# EAGLE design Stackduino-SMD (EAGLE 6.5.0)
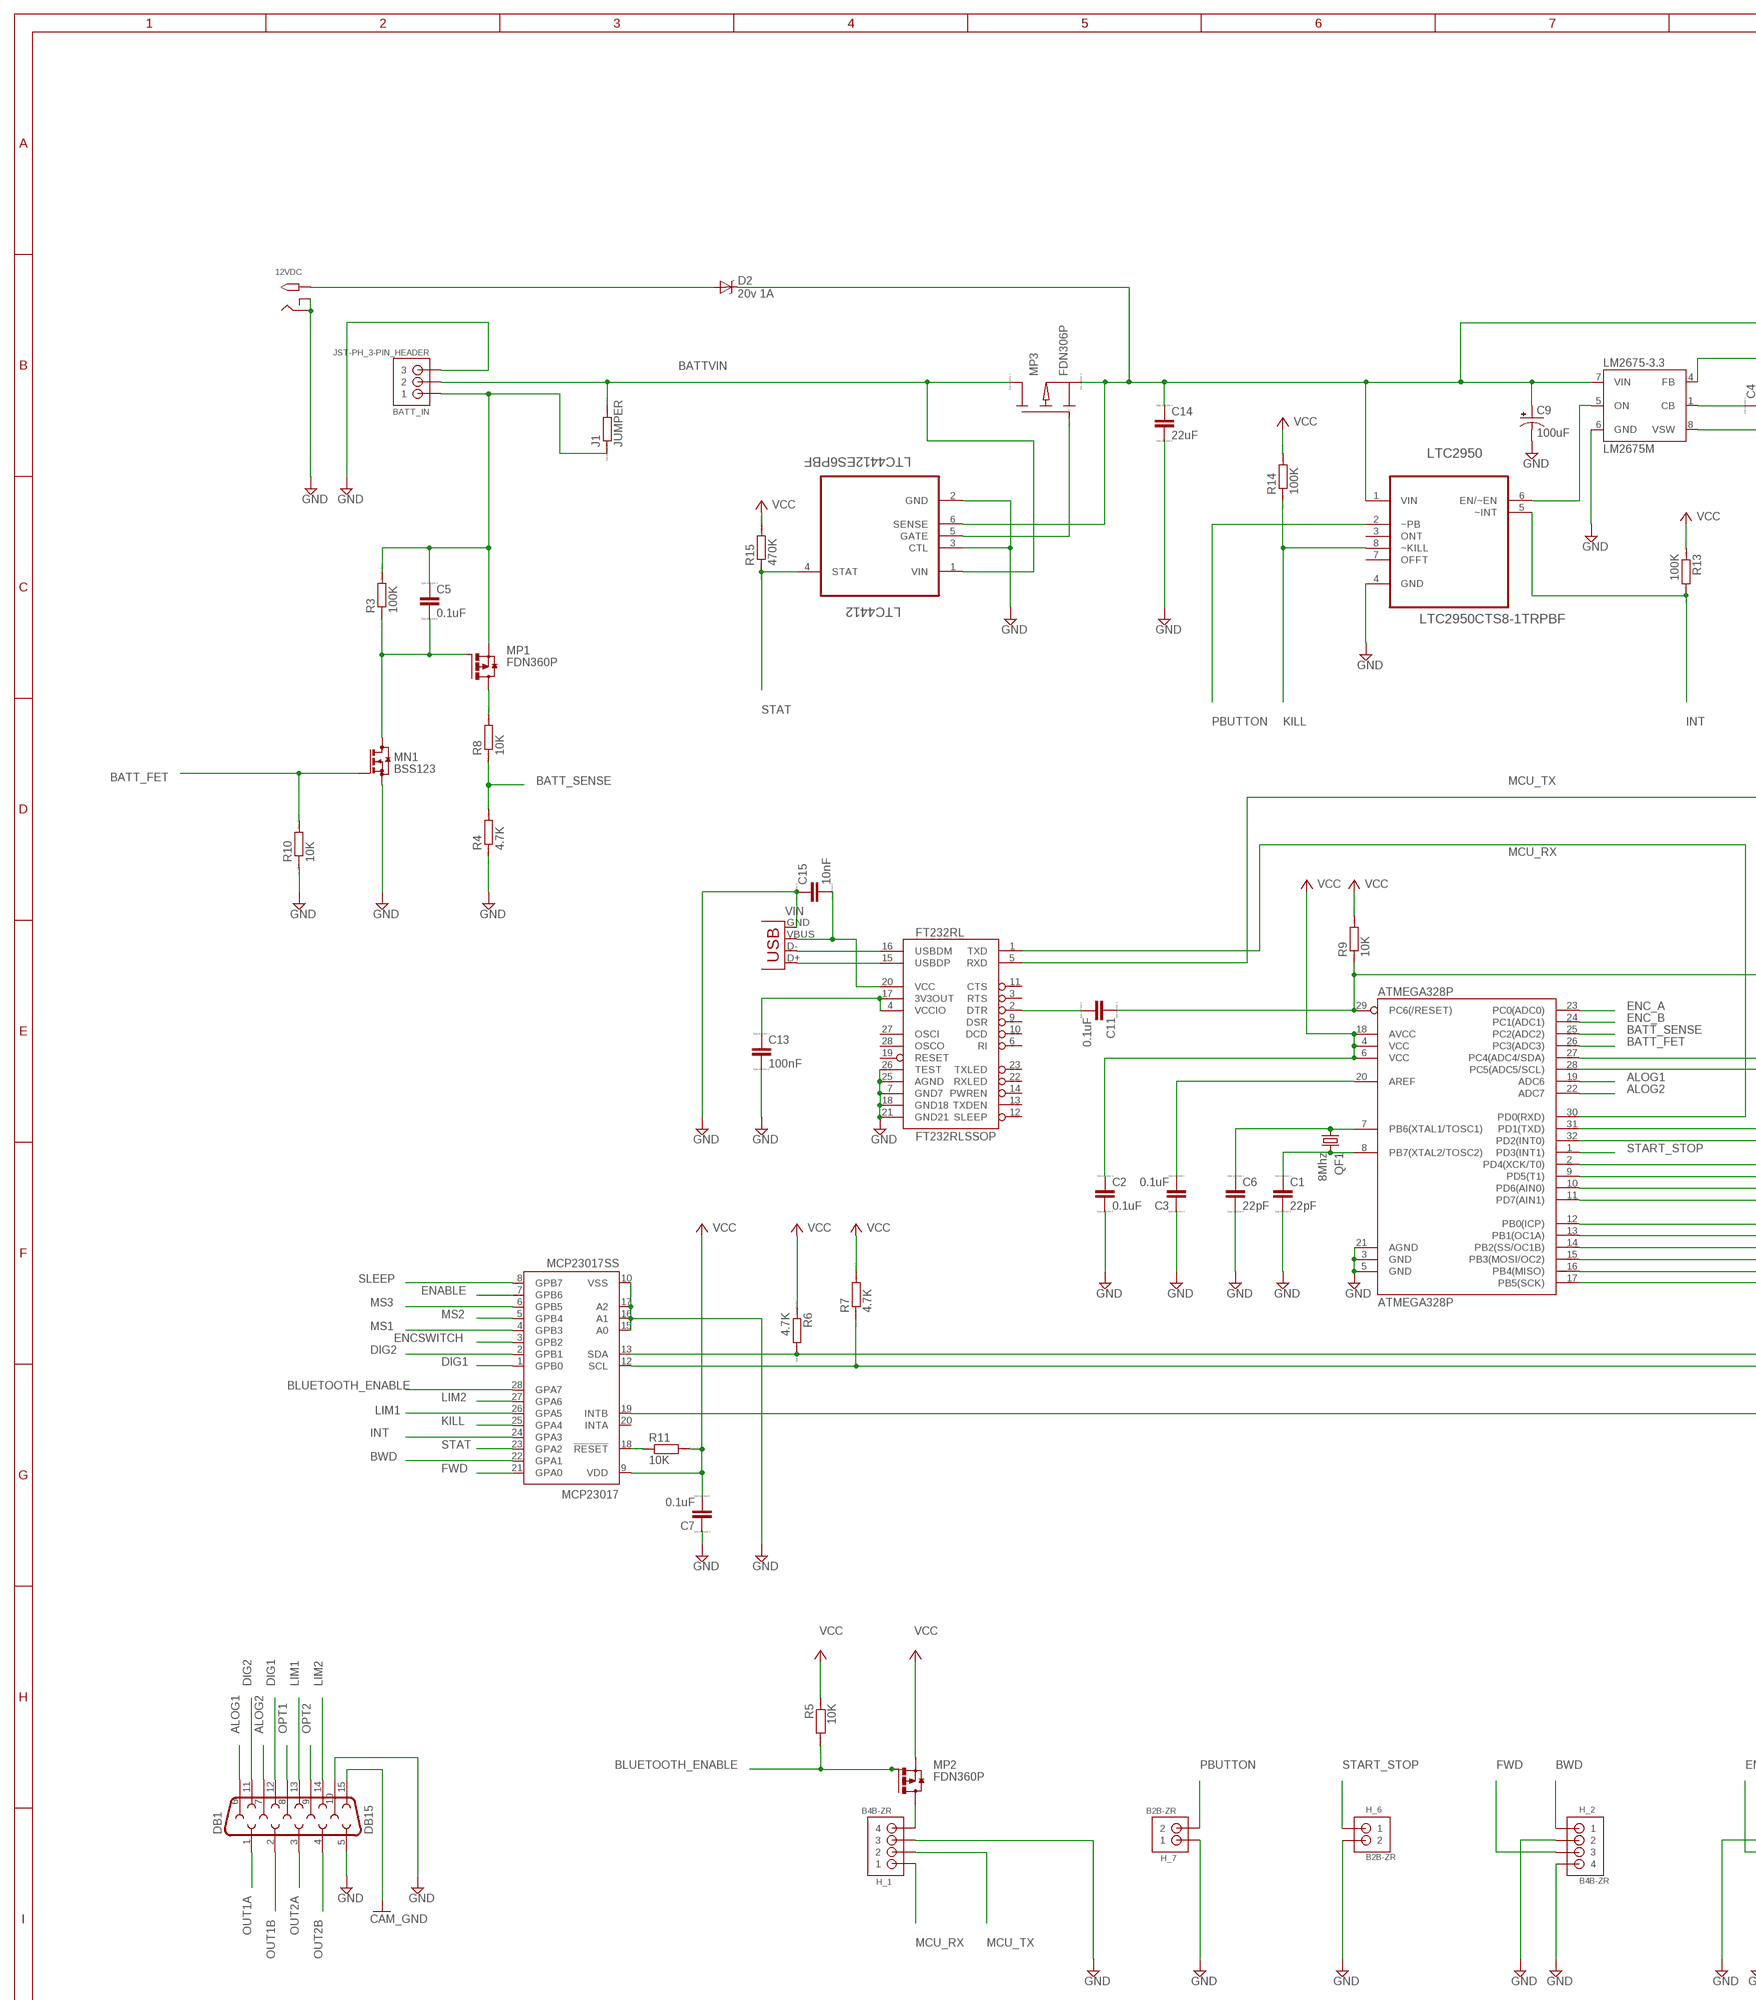
[diagram p0: schematic, sheet 1, part 1 of 2]
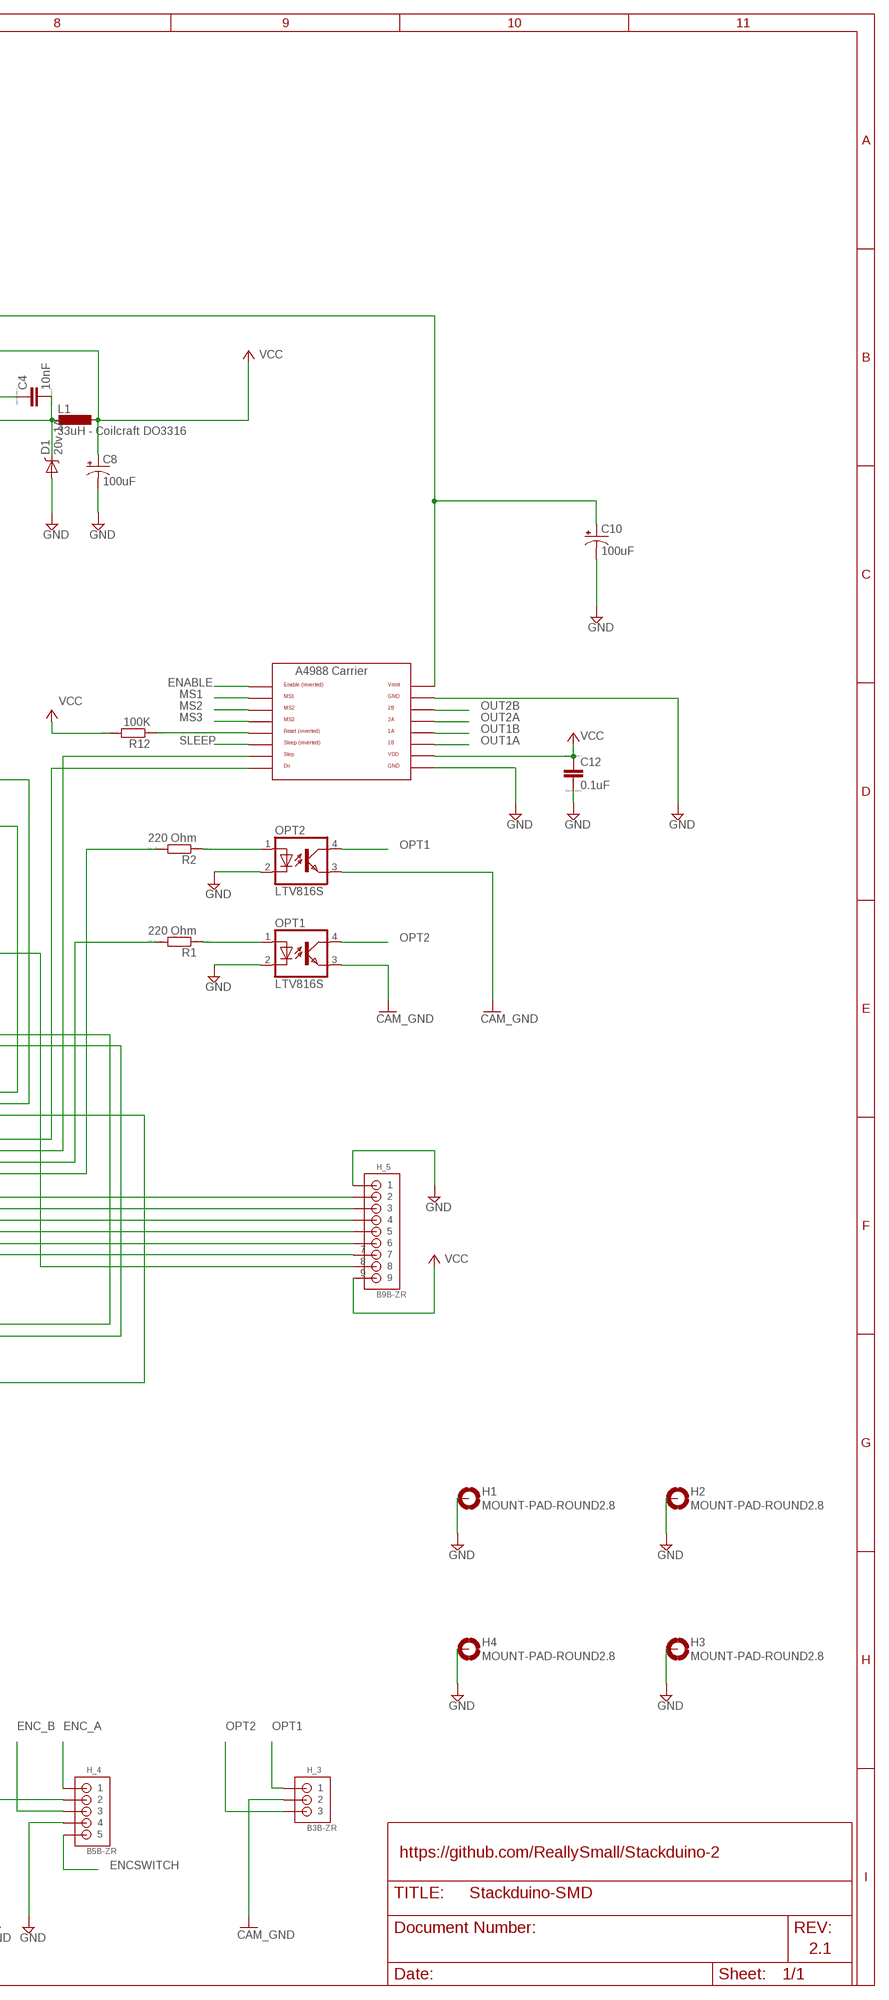
[diagram p1: schematic, sheet 1, part 2 of 2]

## Parts
12VDC  2.1MMJACKTHM  [PJ-102A]
A4988_CARRIER  A4988BREAKOUT  [A4988BREAKOUT]
ATMEGA328P  ATMEGA328P  ATMEGA328_SMT  [TQFP32-08]
BATT_IN  JST-PH_3-PIN_HEADER  [JST_B3B-PH_HEADER]
C1  22pF  C  [C0805]
C2  0.1uF  C  [C0805]
C3  0.1uF  C  [C0805]
C4  10nF  C  [C0805]
C5  0.1uF  C  [C0805]
C6  22pF  C  [C0805]
C7  0.1uF  C  [C0805]
C8  100uF  CAP_POLD  [PANASONIC_D]
C9  100uF  CAP_POLD  [PANASONIC_D]
C10  100uF  CAP_POLD  [PANASONIC_D]
C11  0.1uF  C  [C0805]
C12  0.1uF  C  [C0805]
C13  100nF  C  [C0805]
C14  22uF  C  [C0805]
C15  10nF  C  [C0805]
D1  20v 1A  MBRA140  [SMA-DIODE]
D2  20v 1A  MBRA140  [SMA-DIODE]
DB1  DB15  [DB15]
FT232RL  FT232RLSSOP  [SSOP28DB]
H1  MOUNT-PAD-ROUND2.8  [2,8-PAD]
H2  MOUNT-PAD-ROUND2.8  [2,8-PAD]
H3  MOUNT-PAD-ROUND2.8  [2,8-PAD]
H4  MOUNT-PAD-ROUND2.8  [2,8-PAD]
H_1  B4B-ZR  [B4B-ZR]
H_2  B4B-ZR  [B4B-ZR]
H_3  B3B-ZR  [B3B-ZR]
H_4  B5B-ZR  [B5B-ZR]
H_5  B9B-ZR  [B9B-ZR]
H_6  B2B-ZR  [B2B-ZR]
H_7  B2B-ZR  [B2B-ZR]
J1  JUMPER  R  [R0805]
L1  33uH - Coilcraft DO3316  DO3316P  [DO3316P]
LM2675-3.3  LM2675M  [SO08]
LTC2950  LTC2950CTS8-1TRPBF  [SOT65P280X100-8N]
LTC4412  LTC4412ES6PBF  [SOT95P280X100-6N]
MCP23017  MCP23017SS  [SSOP28]
MN1  BSS123  [SOT23]
MP1  FDN360P  [SUPER-SOT3]
MP2  FDN360P  [SUPER-SOT3]
MP3  FDN306P  PMOS  [SOT23]
OPT1  LTV816S  [SMD4]
OPT2  LTV816S  [SMD4]
QF1  8Mhz  CRYSTALHC49U-V  [HC49U-V]
R1  220 Ohm  R  [R0805]
R2  220 Ohm  R  [R0805]
R3  100K  R  [R0805]
R4  4.7K  R  [R0805]
R5  10K  R  [R0805]
R6  4.7K  R  [R0805]
R7  4.7K  R  [R0805]
R8  10K  R  [R0805]
R9  10K  R  [R0805]
R10  10K  R  [R0805]
R11  10K  R  [R0805]
R12  100K  R  [R0805]
R13  100K  R  [R0805]
R14  100K  R  [R0805]
R15  470K  R  [R0805]
USB  USBSMD  [USB-MINIB]

## Nets
ALOG1: ATMEGA328P.19(ADC6) DB1.6
ALOG2: ATMEGA328P.22(ADC7) DB1.7
BATT_FET: ATMEGA328P.26(PC3(ADC3)) MN1.1(G) R10.2
BATT_SENSE: ATMEGA328P.25(PC2(ADC2)) R4.2 R8.1
BATT_VOLT: BATT_IN.P1 C5.1 J1.1 MP1.2(S) R3.2
BATTVIN: BATT_IN.P2 J1.2 LTC4412.1(VIN) MP3.3(D)
BLUETOOTH_ENABLE: MCP23017.28(GPA7) MP2.1(G) R5.2
BWD: H_2.1 MCP23017.22(GPA1)
CAM_GND: DB1.15 H_3.2 OPT1.3(EMIT) OPT2.3(EMIT)
DIG1: DB1.12 MCP23017.1(GPB0)
DIG2: DB1.11 MCP23017.2(GPB1)
DIR: A4988_CARRIER.DIR ATMEGA328P.2(PD4(XCK/T0))
ENABLE: A4988_CARRIER.EN MCP23017.7(GPB6)
ENC_A: ATMEGA328P.23(PC0(ADC0)) H_4.1
ENC_B: ATMEGA328P.24(PC1(ADC1)) H_4.3
ENCSWITCH: H_4.5 MCP23017.3(GPB2)
FWD: H_2.3 MCP23017.21(GPA0)
GATE: LTC4412.5(GATE) MP3.1(G)
GND: 12VDC.RING 12VDC.RING_SW A4988_CARRIER.GND A4988_CARRIER.GND@0(GND) ATMEGA328P.3(GND) ATMEGA328P.5(GND) ATMEGA328P.21(AGND) BATT_IN.P3 C1.2 C2.2 C3.1 C6.2 C7.1 C8.- C9.- C10.- C12.2 C13.2 C14.2 C15.1 D1.A DB1.5 DB1.10 FT232RL.7(GND7) FT232RL.18(GND18) FT232RL.21(GND21) FT232RL.25(AGND) FT232RL.26(TEST) H1.B2,8(MOUNT) H2.B2,8(MOUNT) H3.B2,8(MOUNT) H4.B2,8(MOUNT) H_1.3 H_2.2 H_2.4 H_4.2 H_4.4 H_5.1 H_6.2 H_7.1 LM2675-3.3.6(GND) LTC2950.4(GND) LTC4412.2(GND) LTC4412.3(CTL) MCP23017.10(VSS) MCP23017.15(A0) MCP23017.16(A1) MCP23017.17(A2) MN1.2(S) OPT1.2(C) OPT2.2(C) R4.1 R10.1 USB.GND
INT: LTC2950.5(~INT) MCP23017.24(GPA3) R13.2
KILL: LTC2950.8(~KILL) MCP23017.25(GPA4) R14.1
LIM1: DB1.13 MCP23017.26(GPA5)
LIM2: DB1.14 MCP23017.27(GPA6)
MCU_RX: ATMEGA328P.30(PD0(RXD)) FT232RL.1(TXD) H_1.1
MCU_TX: ATMEGA328P.31(PD1(TXD)) FT232RL.5(RXD) H_1.2
MISO: ATMEGA328P.16(PB4(MISO)) H_5.6
MOSI: ATMEGA328P.15(PB3(MOSI/OC2)) H_5.5
MS1: A4988_CARRIER.MS1 MCP23017.4(GPB3)
MS2: A4988_CARRIER.MS2 MCP23017.5(GPB4)
MS3: A4988_CARRIER.MS3 MCP23017.6(GPB5)
N$1: LM2675-3.3.5(ON) LTC2950.6(EN/~EN)
N$2: A4988_CARRIER.RST R12.1
N$3: C11.2 FT232RL.2(DTR)
N$4: C4.1 LM2675-3.3.1(CB)
N$5: FT232RL.16(USBDM) USB.D-
N$6: FT232RL.15(USBDP) USB.D+
N$7: C4.2 D1.C L1.1 LM2675-3.3.8(VSW)
N$8: MCP23017.18(!RESET) R11.1
N$11: ATMEGA328P.20(AREF) C3.2
N$13: H_1.4 MP2.3(D)
N$14: C5.2 MN1.3(D) MP1.1(G) R3.1
N$16: MP1.3(D) R8.2
N$17: ATMEGA328P.32(PD2(INT0)) MCP23017.19(INTB)
N$18: ATMEGA328P.28(PC5(ADC5/SCL)) MCP23017.12(SCL) R7.1
N$19: ATMEGA328P.27(PC4(ADC4/SDA)) MCP23017.13(SDA) R6.2
N$22: ATMEGA328P.14(PB2(SS/OC1B)) H_5.4
N$23: ATMEGA328P.12(PB0(ICP)) H_5.2
N$24: ATMEGA328P.13(PB1(OC1A)) H_5.3
N$30: C15.2 FT232RL.20(VCC) USB.VBUS
N$34: OPT2.1(A) R2.1
N$36: OPT1.1(A) R1.1
N$43: C13.1 FT232RL.4(VCCIO) FT232RL.17(3V3OUT)
OPT1: DB1.8 H_3.1 OPT2.4(COL)
OPT2: DB1.9 H_3.3 OPT1.4(COL)
OUT1A: A4988_CARRIER.1B DB1.1
OUT1B: A4988_CARRIER.1A DB1.2
OUT2A: A4988_CARRIER.2A DB1.3
OUT2B: A4988_CARRIER.2B DB1.4
PBUTTON: H_7.2 LTC2950.2(~PB)
PD6: ATMEGA328P.11(PD7(AIN1)) R2.2
PD7: ATMEGA328P.10(PD6(AIN0)) R1.2
RESET: ATMEGA328P.29(PC6(/RESET)) C11.1 H_5.8 R9.1
SCK: ATMEGA328P.17(PB5(SCK)) H_5.7
SLEEP: A4988_CARRIER.SLP(SLEEP) MCP23017.8(GPB7)
START_STOP: ATMEGA328P.1(PD3(INT1)) H_6.1
STAT: LTC4412.4(STAT) MCP23017.23(GPA2) R15.1
STEP: A4988_CARRIER.STEP ATMEGA328P.9(PD5(T1))
V+: A4988_CARRIER.VMOT C9.+ C10.+ C14.1 D2.C LM2675-3.3.7(VIN) LTC2950.1(VIN) LTC4412.6(SENSE) MP3.2(S)
VCC: A4988_CARRIER.VDD ATMEGA328P.4(VCC) ATMEGA328P.6(VCC) ATMEGA328P.18(AVCC) C2.1 C7.2 C8.+ C12.1 H_5.9 L1.2 LM2675-3.3.4(FB) MCP23017.9(VDD) MP2.2(S) R5.1 R6.1 R7.2 R9.2 R11.2 R12.2 R13.1 R14.2 R15.2
VIN: 12VDC.TIP D2.A
XTAL1: ATMEGA328P.7(PB6(XTAL1/TOSC1)) C6.1 QF1.1
XTAL2: ATMEGA328P.8(PB7(XTAL2/TOSC2)) C1.1 QF1.2
Unconnected: FT232RL.3(RTS) FT232RL.6(RI) FT232RL.9(DSR) FT232RL.10(DCD) FT232RL.11(CTS) FT232RL.12(SLEEP) FT232RL.13(TXDEN) FT232RL.14(PWREN) FT232RL.19(RESET) FT232RL.22(RXLED) FT232RL.23(TXLED) FT232RL.27(OSCI) FT232RL.28(OSCO) LTC2950.3(ONT) LTC2950.7(OFFT) MCP23017.20(INTA)

## Notes on the sheet
- https://github.com/ReallySmall/Stackduino-2
- 2.1

## Library data of the parts
12VDC = adafruit:2.1MMJACK: 2.1mm x 5.5mm THM DC jack with internal switch. Digikey part #PJ-102A, 4UCON part #05537 2.1mm x 5.5mm SMT DC jack with internal switch. Digikey part #PJ-002A-SMT, 4UCON part #03267 By microbuilder.eu & adafruit.com
A4988_CARRIER = RepRapjr:A4988BREAKOUT
ATMEGA328P = SparkFun-DigitalIC:ATMEGA328_SMT: 32-Pin Atmega328 part Commonly used on Arduino compatible boards Available in QFP and QFN packages TQFP is IC-09069 QFN is non-stock; PROD_ID: IC-09069
BATT_IN = SRG:JST-PH_3-PIN_HEADER: 3-pin JST PH Shrouded Header, top entry P/N B3B-PH-K-S Mating connector PHR-3
C1-C7 C11-C15 = eagle-ltspice:C: CAPACITOR, European symbol; SPICEMODEL: NONE; SPICEPREFIX: C
C8-C10 = SparkFun-Passives:CAP_POL: Capacitor Polarized These are standard SMD and PTH capacitors. Normally 10uF, 47uF, and 100uF in electrolytic and tantalum varieties. Always verify the external diameter of the through hole cap, it varies with capacity, voltage, and manufacturer. The EIA devices should be standard.
D1 D2 = SparkFun-DiscreteSemi:MBRA140: 40V, 1A Schottky rectifier SMA/DO-214AC package DIO-08053; PROD_ID: DIO-08053
DB1 = SparkFun-Connectors:DB15: DB15 / VGA right angle through-hole female connector.
FT232RL = SparkFun-DigitalIC:FT232RL: USB UART FT232RL 4th Generation USB UART (USB <-> Serial) Controller. Spark Fun Electronics SKU : COM-00650 Production SKU IC-00870; PROD_ID: IC-00870
H1-H4 = holes:MOUNT-PAD-ROUND: MOUNTING PAD, round
H_1 H_2 = jst-connectors:B4B-ZR: JST-ZH Connector 4 pol, 1.5mm pitch Package: B4B-ZR Source: http://www.jst-mfg.com/product/pdf/eng/eZH.pdf
H_3 = jst-connectors:B3B-ZR: JST-ZH Connector 3 pol, 1.5mm pitch Package: B3B-ZR Source: http://www.jst-mfg.com/product/pdf/eng/eZH.pdf
H_4 = jst-connectors:B5B-ZR: JST-ZH Connector 5 pol, 1.5mm pitch Package: B5B-ZR Source: http://www.jst-mfg.com/product/pdf/eng/eZH.pdf
H_5 = jst-connectors:B9B-ZR: JST-ZH Connector 9 pol, 1.5mm pitch Package: B9B-ZR
H_6 H_7 = jst-connectors:B2B-ZR: JST-ZH Connector 2 pol, 1.5mm pitch Package: B2B-ZR
J1 R1-R15 = eagle-ltspice:R: RESISTOR, European symbol; SPICEMODEL: NONE; SPICEPREFIX: R
L1 = inductor-coilcraft:DO3316P: COILCRAFT; OC_FARNELL: unknown; OC_NEWARK: unknown
LM2675-3.3 = v-reg-3:LM2675: National Semiconductor <http://www.national.com> 1.0A "Simple Switcher"(c) 260kHz, Vout 1.2-37V, Vin 40V, 250mOhm DMOS switch, 50µA standby current
LTC2950 = LTC_By_element14_Batch_1:LTC2950CTS8-1TRPBF: Push Button On/Off Controller; MPN: LTC2950CTS8-1#TRPBF; OC_FARNELL: 1537418; OC_NEWARK: 56M7180; PACKAGE: TSOT-23-8; SUPPLIER: Linear Technology
LTC4412 = LTC_By_element14_Batch_1:LTC4412ES6PBF: Low Loss PowerPath Controller; MPN: LTC4412ES6#PBF; OC_FARNELL: 1531480; OC_NEWARK: 61M3335; PACKAGE: TSOT-23-6; SUPPLIER: Linear Technology
MCP23017 = adafruit:MCP23017: http://ww1.microchip.com/downloads/en/DeviceDoc/21952a.pdf Source: http://ww1.microchip.com/downloads/en/DeviceDoc/21952a.pdf
MN1 = transistor-small-signal:BSS123: N-CHANNEL MOS FET
MP1 MP2 = transistor-power:FDN360P: Single P-Channel, PowerTrench (R) MOSFET Source: http://www.fairchildsemi.com/ds/FD/FDN360P.pdf
MP3 = sym:PMOS: P-Channel MOSFET transistor
OPT1 OPT2 = optocoupler:LTV816: OPTO COUPLER Source: LITEON, LTV816.pdf; OC_FARNELL: unknown; OC_NEWARK: unknown
QF1 = crystal:CRYSTAL: CRYSTAL; OC_FARNELL: 1666969; OC_NEWARK: unknown
USB = SparkFun-Connectors:USB: USB Connectors USB-B-PTH is fully proven SKU : PRT-00139/CONN-08278 USB-miniB is fully proven SKU : PRT-00587 USB-A-PCB is untested. USB-A-H is throughly reviewed, but untested. Spark Fun Electronics SKU : PRT-00437 USB-B-SMT is throughly reviewed, but untested. Needs silkscreen touching up. USB-A-S has not been used/tested USB-MB-H has not been used/tested USB-MICROB has been used. CONN-09505

## Board
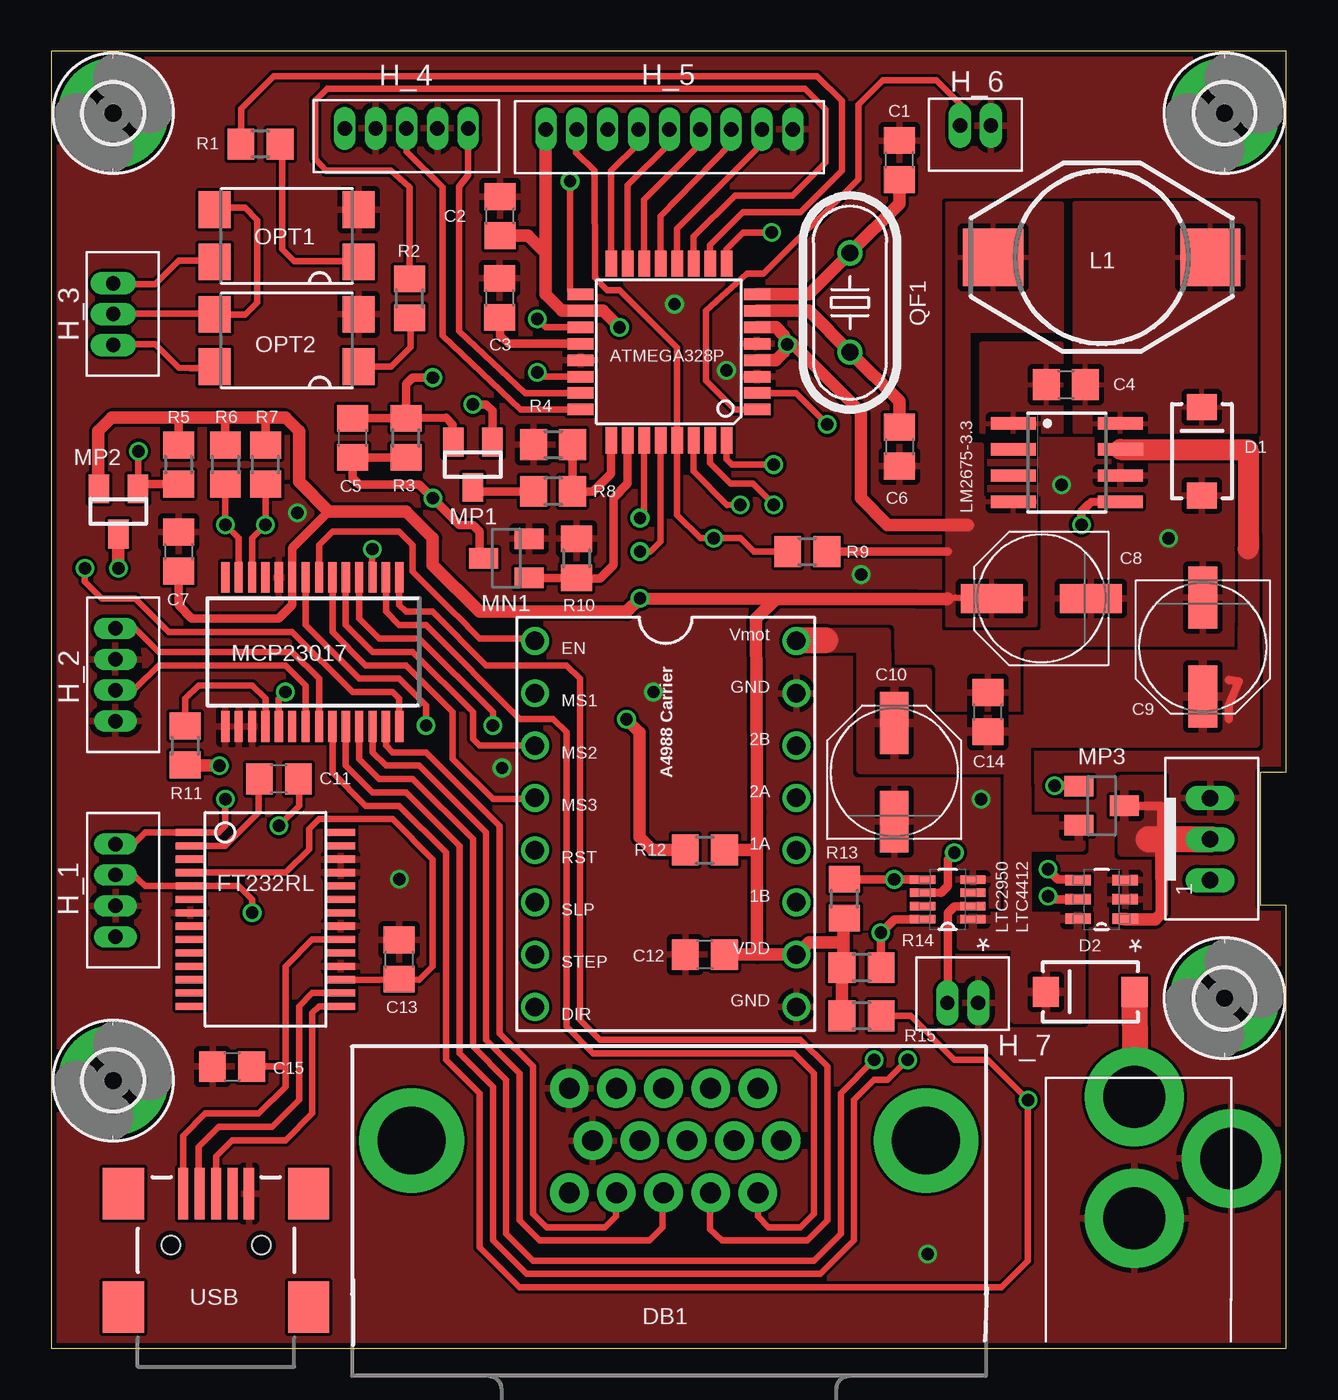
[diagram p2: board, top side]
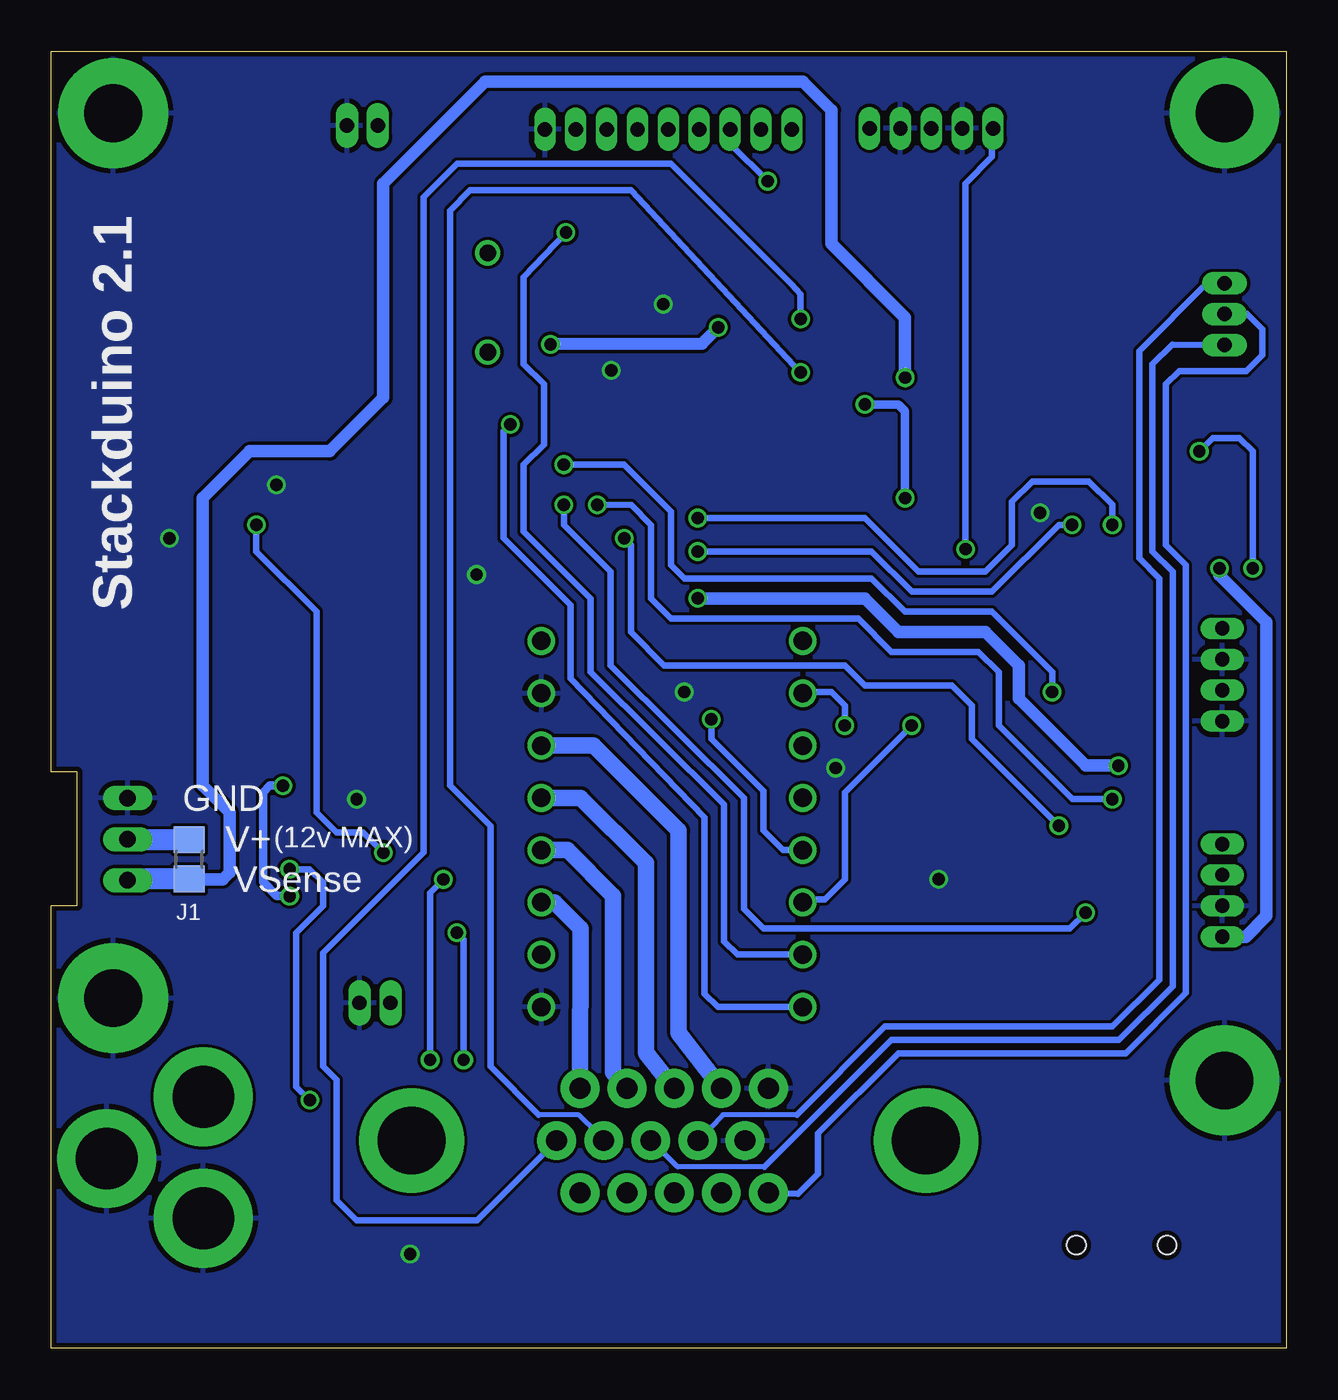
[diagram p3: board, bottom side, seen from below]

Size 60 x 63 mm. Coordinates in mm from the lower left corner, seen from the top.
Outline: 60,0 60,21.5 58.75,21.5 58.75,28 60,28 60,63 0,63 0,0 60,0
Copper layers (1*2*15*16): Top 0.035mm / dielectric 0.2mm / layer 2 0.0175mm / dielectric 1.1mm / layer 15 0.0175mm / dielectric 0.2mm / Bottom 0.035mm
Design rules "SeeedStudio_DRU_no_angle_20130527 *": minimum track width 6mil, minimum drill 12mil, track to track 6mil, track to pad 6mil, pad to pad 6mil, via to via 6mil, smd to smd 0mil, copper to edge 10mil, drill to drill 10mil, minimum pad ring 6mil, minimum via ring 6mil, stop-mask expansion 2mil, vias tented up to drill 25mil, thermal gap 10mil

### Footprints (pad centres in the part's own frame; a part is rotated, then mirrored left to right if it is on the bottom)
PJ-102A = drill 3 pad 4.8: RING 0.1,-3.39; RING_SW -4.6,-6.29; TIP 0.1,-9.29
A4988BREAKOUT = drill 0.9: 1A 8.89,1.27; 1B 11.43,1.27; 2A 6.35,1.27; 2B 3.81,1.27; DIR 16.51,-11.43; EN -1.27,-11.43; GND 16.51,1.27; GND@0 1.27,1.27; MS1 1.27,-11.43; MS2 3.81,-11.43; MS3 6.35,-11.43; RST 8.89,-11.43; SLP 11.43,-11.43; STEP 13.97,-11.43; VDD 13.97,1.27; VMOT -1.27,1.27
TQFP32-08 = smd 1.27 x 0.559: 1 -4.293,2.8; 2 -4.293,2; 3 -4.293,1.2; 4 -4.293,0.4; 5 -4.293,-0.4; 6 -4.293,-1.2; 7 -4.293,-2; 8 -4.293,-2.8; 17 4.293,-2.8; 18 4.293,-2; 19 4.293,-1.2; 20 4.293,-0.4; 21 4.293,0.4; 22 4.293,1.2; 23 4.293,2; 24 4.293,2.8 | smd 0.559 x 1.27: 9 -2.8,-4.293; 10 -2,-4.293; 11 -1.2,-4.293; 12 -0.4,-4.293; 13 0.4,-4.293; 14 1.2,-4.293; 15 2,-4.293; 16 2.8,-4.293; 25 2.8,4.293; 26 2,4.293; 27 1.2,4.293; 28 0.4,4.293; 29 -0.4,4.293; 30 -1.2,4.293; 31 -2,4.293; 32 -2.8,4.293
JST_B3B-PH_HEADER = drill 0.8 long: P1 2.027,0.048; P2 0.028,0.048; P3 -1.972,0.048
C0805 = smd 1.3 x 1.5: 1 -0.95,0; 2 0.95,0
PANASONIC_D = smd 3 x 1.4: + 2.4,0; - -2.4,0
SMA-DIODE = smd 1.27 x 1.47: A -2.15,0; C 2.15,0
DB15 = drill 1.016 pad 1.88: 1 -4.32,-7.62; 2 -2.03,-7.62; 3 0.26,-7.62; 4 2.55,-7.62; 5 4.84,-7.62; 6 -5.46,-5.08; 7 -3.17,-5.08; 8 -0.88,-5.08; 9 1.41,-5.08; 10 3.7,-5.08; 11 -4.32,-2.54; 12 -2.03,-2.54; 13 0.26,-2.54; 14 2.55,-2.54; 15 4.84,-2.54 | drill 3.302 pad 5.08: G1 -12.5,-5.08; G2 12.5,-5.08
SSOP28DB = smd 0.348 x 1.397: 1 -4.225,-3.656; 2 -3.575,-3.656; 3 -2.925,-3.656; 4 -2.275,-3.656; 5 -1.625,-3.656; 6 -0.975,-3.656; 7 -0.325,-3.656; 8 0.325,-3.656; 9 0.975,-3.656; 10 1.625,-3.656; 11 2.275,-3.656; 12 2.925,-3.656; 13 3.575,-3.656; 14 4.225,-3.656; 15 4.225,3.656; 16 3.575,3.656; 17 2.925,3.656; 18 2.275,3.656; 19 1.625,3.656; 20 0.975,3.656; 21 0.325,3.656; 22 -0.325,3.656; 23 -0.975,3.656; 24 -1.625,3.656; 25 -2.275,3.656; 26 -2.925,3.656; 27 -3.575,3.656; 28 -4.225,3.656
2,8-PAD = drill 2.8 pad 5.334: B2,8 0,0
B4B-ZR = drill 0.7 long: 1 6,-1.3; 2 4.5,-1.3; 3 3,-1.3; 4 1.5,-1.3
B3B-ZR = drill 0.7 pad 1.1 long: 1 -1.5,0; 2 0,0; 3 1.5,0
B5B-ZR = drill 0.7 long: 1 3,0.013; 2 1.5,0.013; 3 0,0.013; 4 -1.5,0.013; 5 -3,0.013
B9B-ZR = drill 0.7 long: 1 6.025,-0.03; 2 4.525,-0.03; 3 3.025,-0.03; 4 1.525,-0.03; 5 0.025,-0.03; 6 -1.475,-0.03; 7 -2.975,-0.03; 8 -4.475,-0.03; 9 -5.975,-0.03
B2B-ZR = drill 0.7 pad 1.1 long: 1 0.92,-0.75; 2 2.42,-0.75
R0805 = smd 1.3 x 1.5: 1 -0.95,0; 2 0.95,0
DO3316P = smd 2.92 x 2.79: 1 -5.28,0; 2 5.28,0
SO08 = smd 0.6 x 2.2: 1 -1.905,-2.6; 2 -0.635,-2.6; 3 0.635,-2.6; 4 1.905,-2.6; 5 1.905,2.6; 6 0.635,2.6; 7 -0.635,2.6; 8 -1.905,2.6
SOT65P280X100-8N = smd 1.219 x 0.406: 1 -1.219,0.965; 2 -1.219,0.33; 3 -1.219,-0.33; 4 -1.219,-0.965; 5 1.219,-0.965; 6 1.219,-0.33; 7 1.219,0.33; 8 1.219,0.965
SOT95P280X100-6N = smd 1.219 x 0.508: 1 -1.143,0.94; 2 -1.143,0; 3 -1.143,-0.94; 4 1.143,-0.94; 5 1.143,0; 6 1.143,0.94
SSOP28 = smd 0.4 x 1.5: 1 -4.225,-3.625; 2 -3.575,-3.625; 3 -2.925,-3.625; 4 -2.275,-3.625; 5 -1.625,-3.625; 6 -0.975,-3.625; 7 -0.325,-3.625; 8 0.325,-3.625; 9 0.975,-3.625; 10 1.625,-3.625; 11 2.275,-3.625; 12 2.925,-3.625; 13 3.575,-3.625; 14 4.225,-3.625; 15 4.225,3.625; 16 3.575,3.625; 17 2.925,3.625; 18 2.275,3.625; 19 1.625,3.625; 20 0.975,3.625; 21 0.325,3.625; 22 -0.325,3.625; 23 -0.975,3.625; 24 -1.625,3.625; 25 -2.275,3.625; 26 -2.925,3.625; 27 -3.575,3.625; 28 -4.225,3.625
SOT23 = smd 1 x 1.4: 1 -0.95,-1.1; 2 0.95,-1.1; 3 0,1.1
SUPER-SOT3 = smd 1 x 1.4: 1 -0.95,-1.1; 2 0.95,-1.1; 3 0,1.1
SMD4 = smd 1.78 x 1.55: 1 -1.27,-3.5; 2 1.27,-3.5; 3 1.27,3.5; 4 -1.27,3.5
HC49U-V = drill 0.813: 1 -2.413,0; 2 2.413,0
USB-MINIB = smd 2.5 x 0.5: D+ 2.5,0; D- 2.5,0.8; GND 2.5,-1.6; ID 2.5,-0.8; VBUS 2.5,1.6 | smd 2.5 x 2: MTN1 -3,4.5; MTN2 2.5,4.5; MTN3 -3,-4.5; MTN4 2.5,-4.5 | hole 0.9: 0,2.2; 0,-2.2

### Placement (x,y rotation side)
12VDC  52.72,2.92 180 top
A4988_CARRIER  34.92,33.09 270 top
ATMEGA328P  30,48.4 180 top
BATT_IN  56.25,24.75 270 top
C1  41.2,57.72 90 top
C2  21.8,55 90 top
C3  21.77,51.02 270 top
C4  49.29,46.81 0 top
C5  14.62,44.23 270 top
C6  41.2,43.8 270 top
C7  6.17,38.7 270 top
C8  48.1,36.42 180 top
C9  55.95,34.06 270 top
C10  40.95,27.98 90 top
C11  11.05,27.65 180 top
C12  31.75,19.11 180 top
C13  16.9,18.88 90 top
C14  45.5,30.9 90 top
C15  8.78,13.68 0 top
D1  55.9,43.58 90 top
D2  50.48,17.31 180 top
DB1  30,5 180 top
FT232RL  10.4,20.83 270 top
H1  3,60 180 top
H2  57,60 180 top
H3  57,17 180 top
H4  3,13 180 top
H_1  1.81,18.49 90 top
H_2  1.81,28.96 90 top
H_3  3,50.24 90 top
H_4  17.25,59.25 0 top
H_5  30,59.25 0 top
H_6  43.23,60.15 0 top
H_7  45.95,16.02 180 top
J1  53.3,23.75 90 bottom
L1  51.04,53 180 top
LM2675-3.3  49.34,43.02 270 top
LTC2950  43.55,21.8 180 top
LTC4412  51.02,21.8 180 top
MCP23017  12.68,33.83 180 top
MN1  22.1,38.38 90 top
MP1  20.48,42.92 180 top
MP2  3.25,40.65 180 top
MP3  51.02,26.35 270 top
OPT1  11.43,54.04 90 top
OPT2  11.43,48.96 90 top
QF1  38.8,50.8 90 top
R1  10.16,58.5 180 top
R2  17.4,51 90 top
R3  17.23,44.23 90 top
R4  24.38,43.9 0 top
R5  6.17,42.92 270 top
R6  8.45,42.92 270 top
R7  10.4,42.92 90 top
R8  24.38,41.62 180 top
R9  36.73,38.7 0 top
R10  25.51,38.38 270 top
R11  6.5,29.27 270 top
R12  31.75,24.2 0 top
R13  38.52,21.84 90 top
R14  39.36,18.48 180 top
R15  39.36,16.14 180 top
USB  8,5 90 top

### Tracks (layer width: path | path; a pad name or v marks a point on that pad's centre or on a via)
ALOG1  (via drill 0.6)
  Top 0.305: ATMEGA328P.19 24,49.6 v23.6,50
  Bottom 0.305: DB1.6 39.33,6.2 45.17,6.2 46.15,7.18 46.15,13.02 46.8,13.68 46.8,19.2 41.92,24.08 41.92,55.92 40.3,57.55 29.9,57.55 24.05,51.7 23.6,51.2 v23.6,50
ALOG2  (via drill 0.6)
  Top 0.305: ATMEGA328P.22 23.8,47.2 v23.6,47.4
  Bottom 0.254: 33.48,10.43 34.38,11.33 36.34,11.34
  Bottom 0.305: DB1.7 33.19,10.1 33.48,10.43 | 36.34,11.34 38.67,13.68 38.67,25.38 40.62,27.33 40.62,55.28 39.65,56.25 31.85,56.25 v23.6,47.4
BATT_FET
  Top 0.406: ATMEGA328P.26 28,42 27.3,41.3 27.3,38.05 26.65,37.4 25.35,37.4 R10.2 MN1.1
BATT_SENSE
  Top 0.406: R4.2 R8.1 26.32,41.62 27.2,42.48 ATMEGA328P.25
BATT_VOLT  (via drill 0.6)
  Top 0.406: v18.52,47.15 17.55,47.15 17.23,46.83 R3.2 | C5.1 R3.2 | R3.2 19.18,45.2 19.5,44.88 MP1.2
  Bottom 0.305: 55.6,22.8 BATT_IN.P1 | 53.27,22.77 J1.1
  Bottom 0.406: 56.42,22.8 BATT_IN.P1
  Bottom 0.61: v18.52,47.15 18.52,50.08 22.1,53.65 22.1,60.15 23.48,61.53 38.92,61.53 43.88,56.58 43.88,46.17 46.48,43.58 50.38,43.58 52.65,41.3 52.65,27.33 51.35,26.02 51.35,23.1 51.67,22.77 53.27,22.77
  Bottom 1.016: J1.1 56.42,22.8
BATTVIN
  Top 0.406: 53.3,24.73 54.27,24.4 53.92,24.36 53.94,26.35 MP3.3
  Top 0.61: LTC4412.1 52,20.86 52.16,20.83 53.62,20.83 53.95,21.15 53.92,24.36
  Top 1.27: 53.3,24.73 56.34,24.73 BATT_IN.P2
  Bottom 0.406: 56.38,24.7 BATT_IN.P2
  Bottom 1.016: J1.2 56.38,24.7
  pour Top: 52,27.65 53.95,27.65 54,24.08 52,24.08
BLUETOOTH_ENABLE  (via drill 0.6)
  Top 0.305: MCP23017.28 16.9,31.55 16.57,31.88 14.62,31.88 11.7,34.8 5.69,34.8 4.06,36.42 2.44,36.42 1.62,37.24 v1.62,37.89 | v4.22,43.58 4.22,41.45 MP2.1
  Top 0.406: R5.2 4.53,41.98 MP2.1
  Bottom 0.305: v1.62,37.89 1.62,43.58 2.27,44.23 3.58,44.23 v4.22,43.58
BWD
  Top 0.305: MCP23017.22 13,32.52 11.7,33.83 5.2,33.83 4.06,34.97 H_2.1
CAM_GND
  Top 0.305: OPT1.3 8.26,55.31 8.6,55.4 9.4,55.4 10,54.8 10,50.8 9.4,50.2 8.4,50.2 8.26,50.26 OPT2.3 7.88,50.25 3.42,50.25 3.41,50.24 H_3.2
  Bottom 0.305: H_3.2 1.93,50.25 1.18,49.5 1.18,48.24 1.95,47.48 5.2,47.48 5.85,46.83 5.85,39.02 4.88,38.05 4.88,17.25 7.8,14.32 18.85,14.32 22.75,10.43 22.75,8.48 23.73,7.5 DB1.15
DIG1
  Top 0.305: MCP23017.1 16.9,36.1 17.23,35.77 18.52,35.77 21.12,33.17 25.02,33.17 25.68,32.52 25.68,15.95 26.65,14.98 36.4,14.98 37.7,13.68 37.7,6.2 36.73,5.23 32.57,5.23 32,5.78 DB1.12
DIG2
  Top 0.305: MCP23017.2 16.25,35.77 16.9,35.12 18.2,35.12 22.75,30.58 24.38,30.58 25.02,29.92 25.02,15.62 26.32,14.32 36.08,14.32 37.05,13.35 37.05,6.52 36.4,5.88 34.85,5.88 34.32,6.41 DB1.11
DIR  (via drill 0.6)
  Top 0.305: ATMEGA328P.2 36.17,46.4 v37.7,44.88
  Bottom 0.305: v37.7,44.88 38.02,44.55 38.02,39.35 34.77,36.1 34.77,32.52 28.26,25.78 28.26,17.21 27.62,16.57 A4988_CARRIER.DIR
ENABLE
  Top 0.305: MCP23017.7 13,39.02 13.65,39.67 16.9,39.67 17.55,39.02 17.55,37.73 18.85,36.42 arc-2 20.48,34.8 20.8,34.48 23.07,34.48 A4988_CARRIER.EN
ENC_A
  Top 0.305: ATMEGA328P.23 23,46.4 19.8,49.4 19.8,56.44 20.25,57 H_4.1
ENC_B
  Top 0.305: ATMEGA328P.24 22.8,45.6 19,49.2 19,56.4 17.25,58.12 H_4.3
ENCSWITCH  (via drill 0.6)
  Top 0.305: MCP23017.3 v15.59,38.82
  Bottom 0.305: v15.59,38.82 15.6,56.58 14.3,57.88 14.3,59.17 H_4.5
FWD
  Top 0.305: MCP23017.21 12.35,32.2 11.38,33.17 5.2,33.17 4.06,32.04 3.58,32.04 3.2,31.97 H_2.3
GATE  (via drill 0.6)
  Top 0.406: LTC4412.5 48.59,21.8 v48.42,21.96 | v48.75,27.33 50.05,27.33 MP3.1
  Bottom 0.406: v48.42,21.96 49.05,21.97 49.73,22.65 49.73,27 49.4,27.33 v48.75,27.33
GND  (via drill 0.6)
  other vias: 32.8,47.5 11.96,40.58 30.27,50.73 29.25,31.88 42.58,4.57 45.17,26.67 54.27,39.35 39.34,37.58 16.9,22.77 49.08,41.95 21.89,28.18
  pour Top (rank 2): -1.23,64.42 56,64.03 arc-90 61.23,62.67 62.23,8.09 arc-90 56.99,-1.74 3.55,-1.47 arc-90 -1.06,4.28
  pour Bottom: 60.58,64.45 61.23,1.3 arc-90 57.23,-0.9 1.57,-0.9 arc-90 -1.23,10.5 -1.55,64.55
INT  (via drill 0.6)
  Top 0.305: MCP23017.24 14.3,28.3 15.6,27 17.23,27 19.82,24.4 19.82,14.32 21.45,12.7 21.45,5.23 23.07,3.6 37.38,3.6 39,5.23 39,12.05 39.98,13.02 40.62,13.02 v41.6,14
  Top 0.406: LTC2950.5 41.6,22.77 v40.95,22.77 40.3,22.77 38.67,22.77 R13.2
  Bottom 0.305: v41.6,14 41.6,14.33 41.6,14.32 41.6,14.98 41.6,22.12 v40.95,22.77
KILL  (via drill 0.6)
  Top 0.305: MCP23017.25 14.95,28.62 15.93,27.65 17.55,27.65 20.48,24.73 20.48,14.65 22.1,13.02 22.1,5.55 23.4,4.25 37.05,4.25 38.35,5.55 38.35,12.38 v39.98,14
  Top 0.406: LTC2950.8 40.96,20.84 v40.3,20.17 R14.1
  Bottom 0.305: v39.98,14 39.98,19.85 v40.3,20.17
LIM1
  Top 0.305: MCP23017.26 15.6,28.95 16.25,28.3 17.88,28.3 21.12,25.05 21.12,14.98 22.75,13.35 22.75,6.2 23.73,5.23 29.05,5.23 29.7,5.88 29.72,7.3 DB1.13
LIM2
  Top 0.305: MCP23017.27 16.25,29.27 16.57,28.95 18.2,28.95 21.77,25.38 21.77,15.3 23.4,13.68 23.4,6.52 24.05,5.88 26.9,5.88 27.43,6.4 27.43,7.18 DB1.14
MCU_RX  (via drill 0.6)
  Top 0.305: ATMEGA328P.30 31.2,42.6 32.82,40.97 v33.48,40.98 | H_1.1 3.34,24.49 3.99,24.49 4.55,25.05 FT232RL.1 8.12,25.05 8.45,25.38 v8.45,26.67
  Bottom 0.305: v8.45,26.67 10.4,26.67 13.97,30.25 13.97,32.85 14.95,33.83 19.18,33.83 20.8,35.45 29.9,35.45 30.88,36.42 30.88,40 31.82,40.95 v33.48,40.98
MCU_TX  (via drill 0.6)
  Top 0.305: v9.75,21.15 9.75,21.8 9.1,22.45 FT232RL.5 4.55,22.45 4.23,22.76 3.99,22.99 H_1.2 | ATMEGA328P.31 32,43 33,42 34.08,42.01 v35.1,40.98
  Bottom 0.305: v35.1,40.98 35.1,40 32.83,37.73 32.83,33.17 26.35,26.73 26.35,21.34 25.4,20.38 12.38,20.38 10.52,20.39 v9.75,21.15
MISO
  Top 0.305: ATMEGA328P.16 27.2,57.2 28.5,58.5 28.5,59.1 H_5.6
MOSI
  Top 0.305: ATMEGA328P.15 27.99,56.49 30,58.5 30,59.12 H_5.5
MS1  (via drill 0.6)
  Top 0.305: MCP23017.4 14.95,35.45 15.93,34.48 17.88,34.48 21.45,30.9 v21.45,30.25
  Bottom 0.305: v21.45,30.25 21.45,31.23 22.1,31.88 23.4,31.88 A4988_CARRIER.MS1
MS2
  Top 0.305: MCP23017.5 14.3,35.12 15.6,33.83 17.55,33.83 20.48,30.9 20.48,29.6 20.8,29.27 A4988_CARRIER.MS2
MS3
  Top 0.305: MCP23017.6 13.65,34.8 15.28,33.17 17.23,33.17 19.5,30.9 19.5,28.62 21.45,26.67 22.75,26.67 A4988_CARRIER.MS3
N$1  (via drill 0.6)
  Top 0.406: LTC2950.6 43.23,22.12 43.55,22.45 43.55,23.75 v43.88,24.08 | v50.05,40 50.05,40.65 50.38,40.98 50.52,41.11 LM2675-3.3.5
  Bottom 0.305: v43.88,24.08 44.85,25.05 46.15,25.05 47.12,26.02 47.12,35.77 50.05,38.7 v50.05,40
N$2  (via drill 0.6)
  Top 0.61: v27.94,30.55 28.57,29.91 28.57,24.83 29.21,24.2 R12.1
  Bottom 0.305: A4988_CARRIER.RST 24.45,24.2 25.41,25.16 25.41,27.06 27.62,29.27 27.93,29.58 v27.94,30.55
N$3
  Top 0.305: FT232RL.2 8.45,24.4 10.07,26.02 10.07,27 9.78,27.02 C11.2
N$4
  pour Top: 49.08,48.77 45.17,48.77 45.17,44.55 49.08,44.55
N$5
  Top 0.305: USB.D- 7.15,8.48 7.15,9.77 8.12,10.75 10.72,10.75 12.03,12.05 12.03,16.6 12.68,17.25 FT232RL.16
N$6
  Top 0.305: USB.D+ 8.01,9.33 8.78,10.1 11.38,10.1 12.68,11.4 12.68,16.27 13,16.6 FT232RL.15
N$7
  pour Top: 49.73,44.55 58.5,44.55 58.5,55.6 49.73,55.6
N$8
  Top 0.305: MCP23017.18 10.4,31.55 9.75,32.2 7.15,32.2 6.5,31.55 R11.1
N$11
  Top 0.406: ATMEGA328P.20 22.2,48.8 21.8,49.2 21.8,50.05 C3.2
N$13  (via drill 0.6)
  Top 0.61: v3.25,37.89 MP2.3
  Bottom 0.61: v3.25,37.89 3.25,37.56 0.97,35.29 0.97,20.99 1.98,19.99 H_1.4
N$14  (via drill 0.6)
  Top 0.406: R3.1 C5.2 14.62,42.27 14.95,41.95 17.88,41.95 v18.52,41.3 19.82,40 20.48,40 20.8,39.67 20.8,38.58 MN1.3 | v20.48,45.85 21.12,45.85 21.43,45.55 21.43,45.2 MP1.1
  Bottom 0.406: v18.52,41.3 18.52,45.52 18.85,45.85 v20.48,45.85
N$16
  Top 0.406: R8.2 20.48,41.62 MP1.3
N$17  (via drill 0.6)
  Top 0.305: ATMEGA328P.32 32.8,43.2 33.06,42.92 v35.1,42.92 | MCP23017.19 11.05,31.55 v11.38,31.88
  Bottom 0.305: v11.38,31.88 11.38,32.85 14.3,35.77 18.52,35.77 20.15,37.4 29.25,37.4 29.9,38.05 29.9,40.65 32.17,42.92 v35.1,42.92
N$18  (via drill 0.6)
  Top 0.305: MCP23017.12 9.75,39.35 v10.4,40 R7.1 | ATMEGA328P.28 29.6,40.4 29.6,39.19 29.11,38.7 v28.6,38.7
  Bottom 0.305: v10.4,40 11.05,40 14.3,36.75 18.2,36.75 20.15,38.7 v28.6,38.7
N$19  (via drill 0.6)
  Top 0.305: MCP23017.13 9.1,39.35 v8.45,40 R6.2 | ATMEGA328P.27 28.8,40.55 v28.6,40.33
  Bottom 0.305: v8.45,40 8.45,40.98 9.59,42.11 12.35,42.11 13.32,41.14 13.32,39.02 14.62,37.73 17.88,37.73 20.48,40.33 v28.6,40.33
N$22
  Top 0.305: ATMEGA328P.14 28.8,55.8 31.5,58.5 H_5.4
N$23
  Top 0.305: ATMEGA328P.12 30.4,54.4 32.94,56.94 33.33,57.34 34.5,58.5 34.5,59 H_5.2
N$24
  Top 0.305: ATMEGA328P.13 29.6,55 33,58.5 H_5.3
N$30
  Top 0.305: USB.VBUS 6.39,10.3 7.47,11.4 10.07,11.4 11.38,12.7 11.38,13.68 | 11.38,13.68 11.38,18.55 12.68,19.85 FT232RL.20 | C15.2 11.38,13.68
N$34
  Top 0.305: OPT2.1 16.51,47.69 17.46,48.64 17.46,49.91 R2.1
N$36
  Top 0.305: OPT1.1 14.43,52.77 14.4,52.8 11.8,52.8 11.2,53.4 11.2,58 R1.1
N$43
  Top 0.305: FT232RL.17 15.93,17.9 C13.1 17.88,17.9 18.52,18.55 18.52,23.75 16.57,25.7 13,25.7 12.51,25.21 12.51,24.24 11.38,23.1 FT232RL.4
OPT1
  Top 0.305: H_3.1 3.58,48.77 5.04,48.77 6.17,47.64 6.75,47.62 7.88,47.62 OPT2.4
  Bottom 0.254: 25.35,8.8 29.57,8.8 DB1.8
  Bottom 0.305: H_3.1 5.54,48.74 6.5,47.8 6.5,38.7 5.53,37.73 5.53,17.57 8.12,14.98 19.18,14.98 25.35,8.8
OPT2
  Top 0.305: H_3.3 3.41,51.7 5.04,51.7 6.17,52.84 7.47,52.84 7.5,52.88 OPT1.4
  Bottom 0.254: 23.78,11.33 27.38,11.33 DB1.9
  Bottom 0.305: H_3.3 3.85,51.74 7.15,48.45 7.15,38.38 6.17,37.4 6.17,17.9 8.45,15.62 19.5,15.62 23.78,11.33
OUT1A
  Bottom 0.813: DB1.1 34.29,20.38 35.56,21.66 A4988_CARRIER.1B
OUT1B
  Bottom 0.813: DB1.2 32.7,13.4 32.7,21.97 34.92,24.2 A4988_CARRIER.1A
OUT2A
  Bottom 0.813: DB1.3 31.11,14.35 31.11,23.56 34.29,26.73 A4988_CARRIER.2A
OUT2B
  Bottom 0.813: DB1.4 29.53,15.3 29.53,25.15 33.66,29.27 A4988_CARRIER.2B
PBUTTON
  Top 0.406: LTC2950.2 43.88,21.47 43.55,21.15 43.55,16.93 H_7.2
PD6
  Top 0.305: ATMEGA328P.11 31.2,54 33.2,56 36,56 37.6,57.6 37.6,60.2 36.6,61.2 13.4,61.2 12.8,60.6 12.8,57.8 13.34,57.22 16.51,57.22 17.4,56.4 R2.2
PD7
  Top 0.305: ATMEGA328P.10 32,53.6 33.6,55.2 36.4,55.2 38.4,57.2 38.4,60.6 37.2,61.8 10.8,61.8 9.21,60.21 R1.2
RESET  (via drill 0.6)
  Top 0.152: 30.48,43.88 ATMEGA328P.29
  Top 0.305: R9.1 34.12,38.7 33.48,39.35 v32.17,39.35 31.52,39.35 30.4,40.47 ATMEGA328P.29 30.4,48.6 27.6,51.4 27,51.4 26.4,52 26.4,57.2 25.5,58.09 25.5,59.19 H_5.8 | C11.1 12.03,26.67 12.03,26.35 v11.05,25.38
  Bottom 0.305: v11.05,25.38 15.28,29.6 15.28,31.23 16.25,32.2 20.48,32.2 21.45,33.17 30.23,33.17 31.85,34.8 31.85,39.02 v32.17,39.35
SCK  (via drill 0.6)
  Top 0.305: v25.2,56.69 25.2,52.8 25.2,51.4 25.6,51.2 ATMEGA328P.17
  Bottom 0.305: v25.2,56.69 27,58.5 27,59 H_5.7
SLEEP  (via drill 0.6)
  Top 0.305: v18.2,30.25 18.2,31.23 16.9,32.52 14.95,32.52 12.35,35.12 MCP23017.8
  Bottom 0.305: A4988_CARRIER.SLP 23.4,21.8 22.43,21.8 21.45,22.77 21.45,27 v18.2,30.25
START_STOP
  Top 0.305: ATMEGA328P.1 33.2,45.6 31.8,47 31.8,50.4 33.8,52.2 34.6,52.2 39.2,56.8 39.2,60.4 40.4,61.6 43,61.6 44.17,60.42 44.17,59.8 H_6.1
STAT  (via drill 0.6)
  Top 0.305: MCP23017.23 13.65,27.98 15.28,26.35 16.9,26.35 19.18,24.08 19.18,14 20.8,12.38 20.8,4.9 22.75,2.95 46.15,2.95 47.45,4.25 v47.45,12.05 45.5,14 43.88,14 41.75,16.14 R15.1
  Top 0.406: LTC4412.4 49.73,22.77 48.91,22.77 v48.42,23.26
  Bottom 0.305: v48.42,23.26 47.45,23.26 46.8,22.61 46.8,21.48 48.1,20.17 48.1,12.7 v47.45,12.05
STEP  (via drill 0.6)
  Top 0.305: ATMEGA328P.9 32.8,53.4 33.6,54.2 v35,54.2
  Bottom 0.305: v35,54.2 37.05,52.03 37.05,47.8 36.08,46.83 36.08,43.9 37.05,42.92 37.05,39.67 33.8,36.42 33.8,32.85 27.31,26.42 27.31,19.75 26.68,19.11 A4988_CARRIER.STEP
V+
  Top 0.406: 57.2,30.58 57.2,31.26 57.69,32.39 57.2,32.47
  Top 1.016: LM2675-3.3.7 58.15,43.66 58.15,38.83
  Top 1.27: 36.2,34.4 37.6,34.4
  pour Top: 57.83,30.84 52.98,30.25 53.51,30.04 58.5,29.92 58.5,39.35 57.85,39.35
  pour Top: 47.7,33.73 58.52,33.74 58.52,29.38 52.93,29.37 52.93,29.39 47.4,29.39 47.45,20.99 50.05,20.99 50.05,15.95 46.8,15.95 46.8,19.52 44.2,19.52 44.2,20.99 46.48,20.99 46.48,30.58 47.45,30.58 47.45,33.73
  pour Top: 46.88,25.7 50.05,25.7 50.05,24.31 46.88,24.31
  pour Top: 46.8,30.58 46.83,28.08 39.3,28.08 39.3,34 36,34 36,34.8 40.59,34.8 40.62,32.85 42.58,32.85 42.58,30.58
VCC  (via drill 0.6)
  Top 0.305: 43.92,36.48 C8.+ | R11.2 6.83,28.3
  Top 0.406: C7.2 6.17,36.1 6.83,35.45 11.05,35.45 11.7,36.1 MCP23017.9 11.7,38.88 13.47,40.65 | R6.1 8.45,45.2 | R7.2 10.4,45.2 | 40.8,36.39 42,36.4 | R13.1 38.35,20.83 38.48,20.75 | 38.48,18.3 38.35,18.23 R14.2 | R9.2 43.55,38.7 | H_5.9 24,59.22 | R5.1 6.15,43.55 6.17,43.9 6.17,45.2
  Top 0.61: 34.29,19.11 A4988_CARRIER.VDD 36.8,19.71 38.48,19.71 | 34.29,19.11 C12.1 | ATMEGA328P.6 35.2,49.6 35.6,49.2 v35.75,48.77 | v35.75,48.77 35.6,48.4 35.2,48 ATMEGA328P.4 | v35.75,48.77 36,48.8 39.33,45.48 39.33,41.3 40.62,40 44.52,40 | v27.6,49.6 26.8,50.4 ATMEGA328P.18 24.8,50.4 24,51.2 24,53.2 | 35.2,36.4 42,36.4 43.52,36.4 arc90 43.55,36.42 | 35.2,36.4 v28.6,36.42 27.95,35.77 20.8,35.77 18.52,38.05 18.52,39.35 17.23,40.65 13.47,40.65 12.03,42.1 12.03,44.55 11.38,45.2 10.4,45.2 8.45,45.2 6.17,45.2 2.92,45.2 2.27,44.55 2.27,41.62 MP2.2 | 34.29,19.11 34.29,24.2 | 35.2,36.4 34.23,35.44 34.28,27.97 34.29,26.04 34.29,24.2 | R12.2 34.29,24.2 | 38.48,20.75 38.48,19.71 | 38.48,19.71 38.48,18.3 | 6.83,28.3 v8.16,28.3 | R15.2 R14.2 | 24,59.22 24,53.2 | 24,53.2 23.15,54.05 C2.1
  Bottom 0.61: v8.16,28.3 9.75,28.3 13,31.55 13,33.17 14.62,34.8 18.85,34.8 20.48,36.42 v28.6,36.42 | v35.75,48.77 28.4,48.8 v27.6,49.6
  pour Top: 49.08,49.42 44.52,49.42 44.52,43.9 45.17,43.9 45.17,41.3 47.77,41.3 47.77,35.12 43.55,35.12 43.55,55.6 49.08,55.6
VIN
  Top 1.27: D2.A 52.65,14 12VDC.TIP
XTAL1
  Top 0.61: ATMEGA328P.7 36.8,50.4 QF1.1 41.2,46 C6.1
XTAL2
  Top 0.305: QF1.2
  Top 0.61: ATMEGA328P.8 36.8,51.2 QF1.2 | QF1.2 41.2,55.6 C1.1

### Text on the board
tPlace: A4988 Carrier
bPlace: Stackduino 2.1
bNames: GND | (12v MAX) | V+ | VSense
tDocu: o
_tsilk: 1 | 5 | 1 | 9 | 1 | 2 | 3 | 1 | 4 | 1 | 4 | 1 | 1 | 2